# Altium schematic sheet 8-TemperatureSensor.SchDoc
size A4; Author: Fabian Castaño; CompanyName: UdeA; Engineer: Fabian Castaño; Organization: Universidad de Antioquia; Address1: UdeA; Address2: Medellín; Address3: Antioquia; Address4: Colombia 050010; DocumentNumber: 9; Revision: Jaime Osorio; SheetNumber: 9; SheetTotal: 12
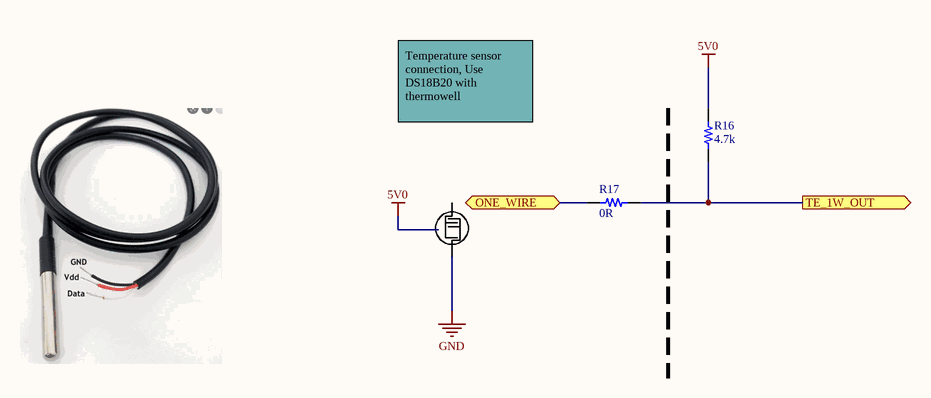
[diagram p0: 8-TemperatureSensor.SchDoc]

## Parts
R16  4.7k  [RES 0805_2012]
R17  0R  [RES 0805_2012]

## Ports
ONE_WIRE, TE_1W_OUT (out)

## Nets
5V0: R16.2
ONE_WIRE: R17.2 ; port ONE_WIRE
TE_1W_OUT: R16.1 R17.1 ; port TE_1W_OUT

## Notes on the sheet
- Temperature sensor connection, Use DS18B20 with thermowell
- Title
- Size:
- Date:
- A4
- Enginner:
- Time:
- Revision:
- Sheet
- of
- Author:
- File:

## Library data of the parts
R16 R17 = RC0805FR-071K47L: RES SMD 1.47K OHM 1% 1/8W 0805; Manufacturer: Yageo; Power (Watts): 0.125W, 1/8W; Resistance: 1.47 kOhms; Temperature Coefficient: ±100ppm/°C; Part Number: RC0805FR-071K47L; ComponentLink1Description: Datasheet; ComponentLink1URL: https://www.yageo.com/upload/media/product/productsearch/datasheet/rchip/PYu-RC_Group_51_RoHS_L_10.pdf; ComponentLink2Description: DigiKey Link; ComponentLink2URL: http://digikey.com/product-detail/en/yageo/RC0805FR-071K47L/311-1.47KCRCT-ND/730440; Composition: Thick Film; Device Package: 0805 (2012 Metric); Features: Moisture Resistant; Height - Seated (Max): 0.024" (0.60mm); LastUpdated: 2/09/2020 01:14:46; Lifecycle Status: Active; Minimum Order: 1; Number of Terminations: 2; Operating Temperature: -55°C ~ 155°C; Package / Case: 0805 (2012 Metric); Packaging: CutTape; PartId: 44768; Part Status: Active; Price: 0.10; Series: RC; Size / Dimension: 0.079" L x 0.049" W (2.00mm x 1.25mm); Supplier 1: DigiKey; Supplier Part Number 1: 311-1.47KCRCT-ND; Supplier Device Package: 0805; Tolerance: ±1%
  R16: Value: 4.7k
  R17: Value: 0R